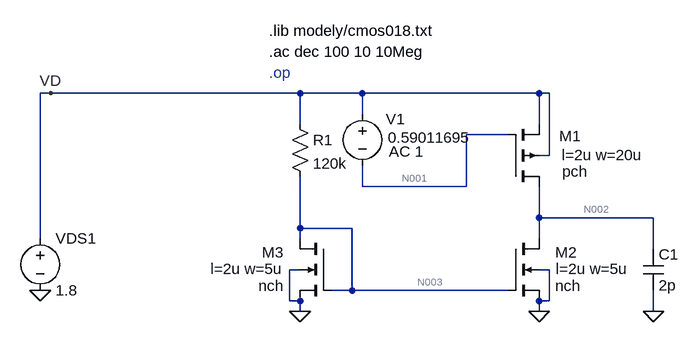
[diagram p0: schematic ses-akt-zatez.asc]
ses-akt-zatez.asc, the LTspice schematic file:
Version 4
SHEET 1 880 680
WIRE -416 32 -432 32
WIRE -32 32 -416 32
WIRE 64 32 -32 32
WIRE 336 32 64 32
WIRE 352 32 336 32
WIRE 64 64 64 32
WIRE -32 80 -32 32
WIRE 336 80 336 32
WIRE 288 96 224 96
WIRE 352 128 352 32
WIRE 352 128 336 128
WIRE 64 176 64 144
WIRE 224 176 224 96
WIRE 224 176 64 176
WIRE 336 224 336 176
WIRE 512 224 336 224
WIRE -32 240 -32 160
WIRE 48 240 -32 240
WIRE -432 256 -432 32
WIRE -32 256 -32 240
WIRE 336 256 336 224
WIRE 512 272 512 224
WIRE -32 304 -48 304
WIRE 352 304 336 304
WIRE 48 336 48 240
WIRE 48 336 16 336
WIRE 288 336 48 336
WIRE -48 352 -48 304
WIRE -32 352 -48 352
WIRE 352 352 352 304
WIRE 352 352 336 352
WIRE -32 368 -32 352
WIRE 336 368 336 352
WIRE 512 368 512 336
FLAG 336 368 0
FLAG -432 336 0
FLAG -416 32 VD
FLAG 512 368 0
FLAG -32 368 0
DATAFLAG -16 240 ""
DATAFLAG 448 224 ""
SYMBOL voltage -432 240 R0
WINDOW 123 0 0 Left 0
WINDOW 39 0 0 Left 0
SYMATTR InstName VDS1
SYMATTR Value 1.8
SYMBOL pmos4 288 176 M180
WINDOW 123 83 49 Left 2
WINDOW 0 79 78 Left 2
WINDOW 3 84 23 Left 2
SYMATTR Value2 l=2u w=20u
SYMATTR InstName M1
SYMATTR Value pch
SYMBOL voltage 64 48 R0
WINDOW 0 36 24 Left 2
WINDOW 3 39 52 Left 2
WINDOW 123 41 74 Left 2
WINDOW 39 0 0 Left 0
SYMATTR InstName V1
SYMATTR Value 0.59011695
SYMATTR Value2 AC 1
SYMBOL cap 496 272 R0
SYMATTR InstName C1
SYMATTR Value 2p
SYMBOL nmos4 288 256 R0
WINDOW 0 73 21 Left 2
WINDOW 3 73 73 Left 2
WINDOW 123 74 47 Left 2
SYMATTR InstName M2
SYMATTR Value nch
SYMATTR Value2 l=2u w=5u
SYMBOL nmos4 16 256 M0
WINDOW 0 73 21 Left 2
WINDOW 3 73 73 Left 2
WINDOW 123 74 47 Left 2
SYMATTR InstName M3
SYMATTR Value nch
SYMATTR Value2 l=2u w=5u
SYMBOL res -48 64 R0
SYMATTR InstName R1
SYMATTR Value 120k
TEXT -80 -64 Left 2 !.lib modely/cmos018.txt
TEXT -80 -32 Left 2 !.ac dec 100 10 10Meg
TEXT -80 0 Left 2 ;.op

The netlist it stands for:
* ses-akt-zatez.asc
VDS1 VD 0 1.8
M1 N002 N001 VD VD pch l=2u w=20u
V1 VD N001 0.59011695 AC 1
C1 N002 0 2p
M2 N002 N003 0 0 nch l=2u w=5u
M3 N003 N003 0 0 nch l=2u w=5u
R1 VD N003 120k
.model NMOS NMOS
.model PMOS PMOS
.lib standard.mos
.lib modely/cmos018.txt
.ac dec 100 10 10Meg
* .op
.backanno
.end

* Results of the author's LTspice run, read from the files saved beside the schematic
* Operating Point, zero values left out:
*   V(vd) = 1.8 V
*   V(n002) = 900 mV
*   V(n001) = 1.21 V
*   V(n003) = 582.2 mV
*   Id(M1) = -10.3 µA
*   Is(M1) = 10.3 µA
*   Id(M2) = 10.3 µA
*   Is(M2) = -10.3 µA
*   Id(M3) = 10.15 µA
*   Is(M3) = -10.15 µA
*   I(R1) = 10.15 µA
*   I(Vds1) = -20.45 µA
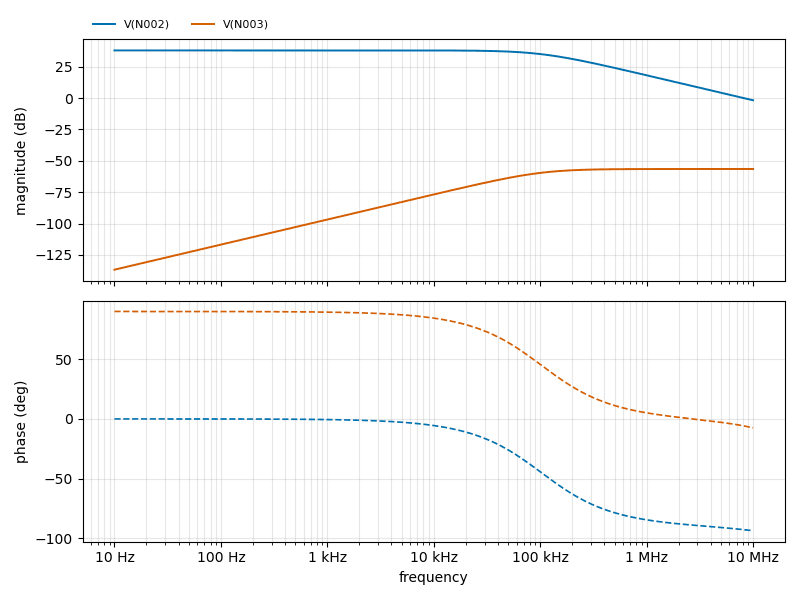
[diagram p1: AC Analysis of ses-akt-zatez.asc, plotted from the saved traces]
* AC Analysis, 1 run:
*   V(N002): 37.93 dB at 10 Hz, -1.81 dB at 10 MHz, peak 37.93 dB at 10 Hz, 3 dB below the peak at 102.7 kHz
*   V(N003): -136.75 dB at 10 Hz, -56.52 dB at 10 MHz, peak -56.52 dB at 10 MHz, 3 dB below the peak at 102.8 kHz